# Altium schematic sheet Main.SchDoc: Digital Input Breakout Board
size Letter; Revision: 1.0; SheetNumber: 1; SheetTotal: 2; Client: Facebook; LeaflabsProject: Sawyer
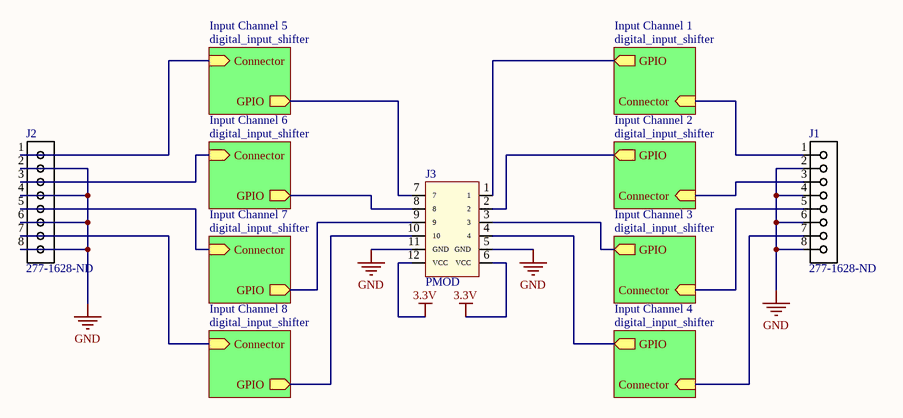
[diagram p0: Main.SchDoc]

## Parts
J1  Supplier Part Number 1: 277-1628-ND  [PHOENIX_8]  (hidden comment: Phoenix Teminal Block)
J2  Supplier Part Number 1: 277-1628-ND  [PHOENIX_8]  (hidden comment: Phoenix Teminal Block)
J3  PMOD  [PMOD_6x2_male]

## Sub-sheets
Input Channel 1 = digital_input_shifter: Connector (in), GPIO (out)
Input Channel 2 = digital_input_shifter: GPIO (out), Connector (in)
Input Channel 3 = digital_input_shifter: GPIO (out), Connector (in)
Input Channel 4 = digital_input_shifter: GPIO (out), Connector (in)
Input Channel 5 = digital_input_shifter: GPIO (out), Connector (in)
Input Channel 6 = digital_input_shifter: GPIO (out), Connector (in)
Input Channel 7 = digital_input_shifter: Connector (in), GPIO (out)
Input Channel 8 = digital_input_shifter: Connector (in), GPIO (out)

## Nets
3.3V: J3.6(VCC) J3.12(VCC)
GND: J1.2 J1.4 J1.6 J1.8 J2.2 J2.4 J2.6 J2.8 J3.5(GND) J3.11(GND)
NetJ1_1: J1.1 ; sheet Input Channel 1/Connector
NetJ1_3: J1.3 ; sheet Input Channel 2/Connector
NetJ1_5: J1.5 ; sheet Input Channel 3/Connector
NetJ1_7: J1.7 ; sheet Input Channel 4/Connector
NetJ2_1: J2.1 ; sheet Input Channel 5/Connector
NetJ2_3: J2.3 ; sheet Input Channel 6/Connector
NetJ2_5: J2.5 ; sheet Input Channel 7/Connector
NetJ2_7: J2.7 ; sheet Input Channel 8/Connector
NetJ3_1: J3.1 ; sheet Input Channel 1/GPIO
NetJ3_2: J3.2 ; sheet Input Channel 2/GPIO
NetJ3_3: J3.3 ; sheet Input Channel 3/GPIO
NetJ3_4: J3.4 ; sheet Input Channel 4/GPIO
NetJ3_7: J3.7 ; sheet Input Channel 5/GPIO
NetJ3_8: J3.8 ; sheet Input Channel 6/GPIO
NetJ3_9: J3.9 ; sheet Input Channel 7/GPIO
NetJ3_10: J3.10 ; sheet Input Channel 8/GPIO

## Notes on the sheet
- PROJ
- TITLE
- CLIENT
- REV
- DATE
- LeafLabs
- SHEET
- OF
- CONFIDENTIAL. DO NOT DISTRIBUTE.

## Library data of the parts
J3 = PMOD Male 2-row: 2x6 PMOD right angle board connector.
J1 J2 = Phoenix Teminal Block: Supplier 1: Digi-Key